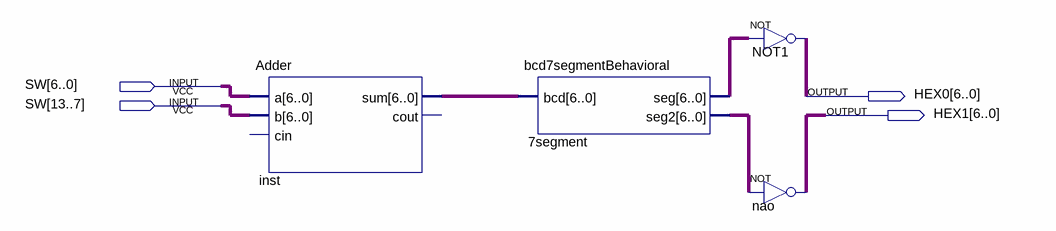
[diagram p0: schematic sheet]
// Quartus schematic testeee.bdf as structural Verilog: 4 symbols, 4 pins
module testeee (
  input  [13:0] SW,
  output [6:0] HEX0,
  output [6:0] HEX1
);

  wire [6:0] inst_sum, n7segment_seg, n7segment_seg2;

  Adder inst (.a(SW[6:0]), .b(SW[13:7]), .sum(inst_sum));  // open: cin, cout
  bcd7segmentBehavioral u_7segment (.bcd(inst_sum), .seg(n7segment_seg), .seg2(n7segment_seg2));
  assign HEX0 = ~n7segment_seg;  // NOT NOT1, 7 bits wide
  assign HEX1 = ~n7segment_seg2;  // NOT nao, 7 bits wide
endmodule
